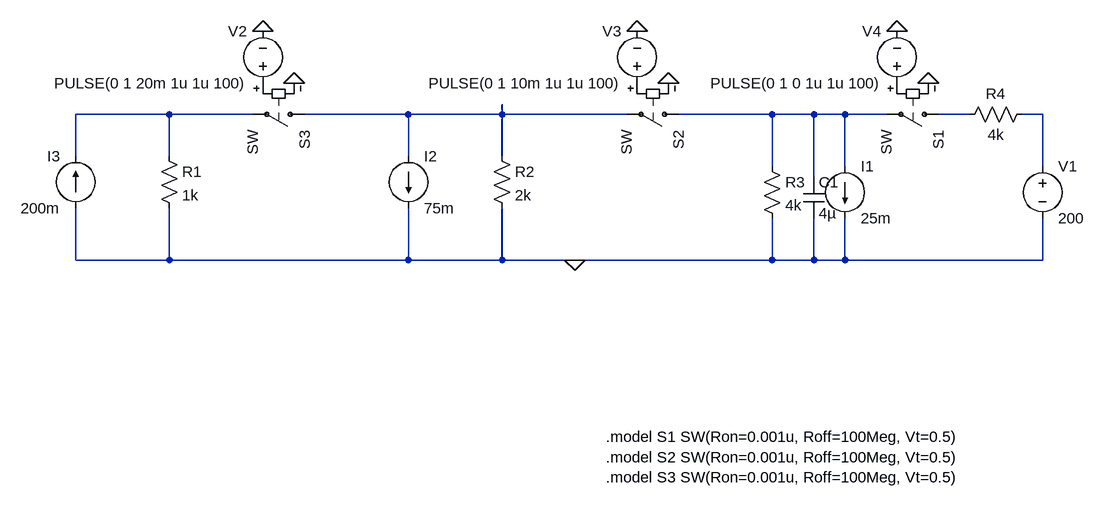
[diagram p0: schematic Draft1.asc]
Draft1.asc, the LTspice schematic file:
Version 4.1
SHEET 1 880 680
WIRE -912 48 -1056 48
WIRE -784 48 -912 48
WIRE -544 48 -704 48
WIRE -400 48 -400 32
WIRE -400 48 -544 48
WIRE -208 48 -400 48
WIRE 16 48 -128 48
WIRE 80 48 16 48
WIRE 128 48 80 48
WIRE 192 48 128 48
WIRE 320 48 272 48
WIRE 432 48 400 48
WIRE -1056 112 -1056 48
WIRE -912 112 -912 48
WIRE -544 112 -544 48
WIRE -400 112 -400 48
WIRE 16 128 16 48
WIRE 128 128 128 48
WIRE 432 128 432 48
WIRE 80 144 80 48
WIRE -1056 272 -1056 192
WIRE -912 272 -912 192
WIRE -912 272 -1056 272
WIRE -544 272 -544 192
WIRE -544 272 -912 272
WIRE -400 272 -400 192
WIRE -400 272 -544 272
WIRE -288 272 -400 272
WIRE 16 272 16 208
WIRE 16 272 -288 272
WIRE 80 272 80 208
WIRE 80 272 16 272
WIRE 128 272 128 208
WIRE 128 272 80 272
WIRE 432 272 432 208
WIRE 432 272 128 272
FLAG -288 272 0
FLAG -144 0 0
FLAG 256 0 0
FLAG -720 0 0
FLAG 208 -80 0
FLAG -192 -80 0
FLAG -768 -80 0
SYMBOL voltage 432 112 R0
SYMATTR InstName V1
SYMATTR Value 200
SYMBOL current 128 128 R0
SYMATTR InstName I1
SYMATTR Value 25m
SYMBOL current -544 112 R0
WINDOW 123 0 0 Left 0
WINDOW 39 0 0 Left 0
SYMATTR InstName I2
SYMATTR Value 75m
SYMBOL current -1056 192 R180
WINDOW 0 24 80 Left 2
WINDOW 3 24 0 Left 2
SYMATTR InstName I3
SYMATTR Value 200m
SYMBOL res -928 96 R0
SYMATTR InstName R1
SYMATTR Value 1k
SYMBOL res -416 96 R0
SYMATTR InstName R2
SYMATTR Value 2k
SYMBOL res 0 112 R0
SYMATTR InstName R3
SYMATTR Value 4k
SYMBOL res 416 32 R90
WINDOW 0 0 56 VBottom 2
WINDOW 3 32 56 VTop 2
SYMATTR InstName R4
SYMATTR Value 4k
SYMBOL cap 64 144 R0
SYMATTR InstName C1
SYMATTR Value 4µ
SYMBOL sw 288 48 R90
SYMATTR InstName S1
SYMBOL sw -112 48 R90
SYMATTR InstName S2
SYMBOL sw -688 48 R90
SYMATTR InstName S3
SYMBOL voltage -768 16 R180
WINDOW 0 24 96 Left 2
WINDOW 3 24 16 Left 2
WINDOW 123 0 0 Left 0
WINDOW 39 0 0 Left 0
SYMATTR InstName V2
SYMATTR Value PULSE(0 1 20m 1u 1u 100)
SYMBOL voltage -192 16 R180
WINDOW 0 24 96 Left 2
WINDOW 3 24 16 Left 2
WINDOW 123 0 0 Left 0
WINDOW 39 0 0 Left 0
SYMATTR InstName V3
SYMATTR Value PULSE(0 1 10m 1u 1u 100)
SYMBOL voltage 208 16 R180
WINDOW 0 24 96 Left 2
WINDOW 3 24 16 Left 2
WINDOW 123 0 0 Left 0
WINDOW 39 0 0 Left 0
SYMATTR InstName V4
SYMATTR Value PULSE(0 1 0 1u 1u 100)
TEXT -240 544 Left 2 !.model S1 SW(Ron=0.001u, Roff=100Meg, Vt=0.5)\n.model S2 SW(Ron=0.001u, Roff=100Meg, Vt=0.5)\n.model S3 SW(Ron=0.001u, Roff=100Meg, Vt=0.5)

The netlist it stands for:
* Draft1.asc
V1 N005 0 200
I1 N003 0 25m
I2 N002 0 75m
I3 0 N001 200m
R1 N001 0 1k
R2 N002 0 2k
R3 N003 0 4k
R4 N005 N004 4k
C1 N003 0 4µ
S1 N004 N003 P001 0 SW
S2 N003 N002 P002 0 SW
S3 N002 N001 P003 0 SW
V2 P003 0 PULSE(0 1 20m 1u 1u 100)
V3 P002 0 PULSE(0 1 10m 1u 1u 100)
V4 P001 0 PULSE(0 1 0 1u 1u 100)
.model S1 SW(Ron=0.001u, Roff=100Meg, Vt=0.5)
.model S2 SW(Ron=0.001u, Roff=100Meg, Vt=0.5)
.model S3 SW(Ron=0.001u, Roff=100Meg, Vt=0.5)
.backanno
.end